# EAGLE schematic daughter_v0 (EAGLE 9.6.2)
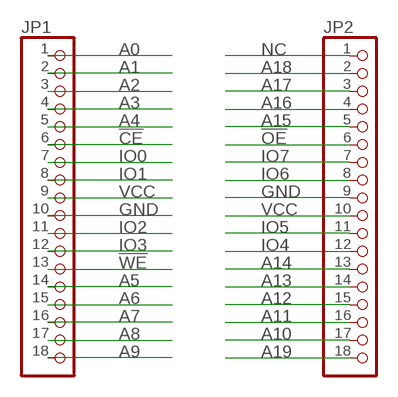
[diagram p0: schematic, sheet 1]

## Parts
JP1  PINHD-1X18  [1X18]
JP2  PINHD-1X18  [1X18]

## Nets
!CE: JP1.6
!OE: JP2.6
!WE: JP1.13
A0: JP1.1
A1: JP1.2
A2: JP1.3
A3: JP1.4
A4: JP1.5
A5: JP1.14
A6: JP1.15
A7: JP1.16
A8: JP1.17
A9: JP1.18
A10: JP2.17
A11: JP2.16
A12: JP2.15
A13: JP2.14
A14: JP2.13
A15: JP2.5
A16: JP2.4
A17: JP2.3
A18: JP2.2
A19: JP2.18
GND: JP1.10 JP2.9
IO0: JP1.7
IO1: JP1.8
IO2: JP1.11
IO3: JP1.12
IO4: JP2.12
IO5: JP2.11
IO6: JP2.8
IO7: JP2.7
NC: JP2.1
VCC: JP1.9 JP2.10

## Library data of the parts
JP1 JP2 = pinhead:PINHD-1X18: PIN HEADER